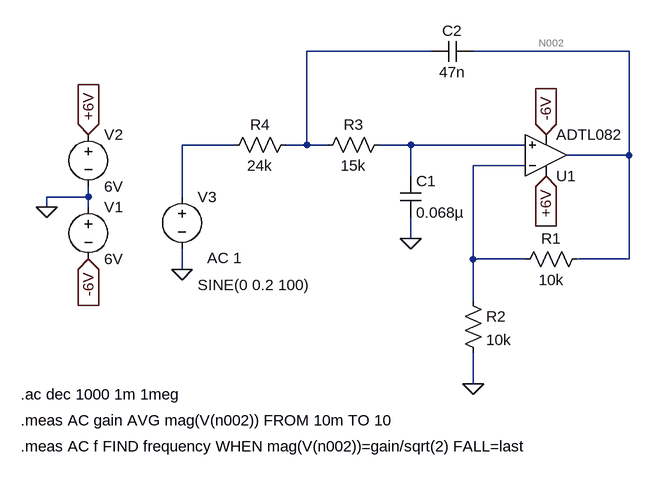
[diagram p0: schematic 150Hz_LPF_NI.asc]
150Hz_LPF_NI.asc, the LTspice schematic file:
Version 4
SHEET 1 880 680
WIRE 416 -64 224 -64
WIRE 720 -64 480 -64
WIRE 112 80 32 80
WIRE 224 80 224 -64
WIRE 224 80 192 80
WIRE 256 80 224 80
WIRE 384 80 336 80
WIRE 560 80 384 80
WIRE 720 96 720 -64
WIRE 720 96 624 96
WIRE 560 112 480 112
WIRE 384 128 384 80
WIRE -112 160 -112 144
WIRE -112 160 -176 160
WIRE 32 160 32 80
WIRE -176 176 -176 160
WIRE -112 176 -112 160
WIRE 384 224 384 192
WIRE 480 256 480 112
WIRE 560 256 480 256
WIRE 720 256 720 96
WIRE 720 256 640 256
WIRE 32 272 32 240
WIRE 480 320 480 256
WIRE 480 448 480 400
FLAG -176 176 0
FLAG -112 64 +6V
IOPIN -112 64 In
FLAG 592 128 +6V
IOPIN 592 128 In
FLAG -112 256 -6V
IOPIN -112 256 In
FLAG 592 64 -6V
IOPIN 592 64 In
FLAG 32 272 0
FLAG 480 448 0
FLAG 384 224 0
SYMBOL voltage -112 160 R0
WINDOW 123 0 0 Left 0
WINDOW 39 0 0 Left 0
SYMATTR InstName V1
SYMATTR Value 6V
SYMBOL voltage -112 48 R0
WINDOW 123 0 0 Left 0
WINDOW 39 0 0 Left 0
SYMATTR InstName V2
SYMATTR Value 6V
SYMBOL OpAmps\\ADTL082 592 160 M180
SYMATTR InstName U1
SYMBOL voltage 32 144 R0
WINDOW 3 24 152 Left 2
WINDOW 123 39 110 Left 2
WINDOW 39 0 0 Left 0
SYMATTR Value SINE(0 0.2 100)
SYMATTR Value2 AC 1
SYMATTR InstName V3
SYMBOL res 656 240 R90
WINDOW 0 0 56 VBottom 2
WINDOW 3 32 56 VTop 2
SYMATTR InstName R1
SYMATTR Value 10k
SYMBOL res 464 304 R0
SYMATTR InstName R2
SYMATTR Value 10k
SYMBOL cap 368 128 R0
SYMATTR InstName C1
SYMATTR Value 0.068µ
SYMBOL res 352 64 R90
WINDOW 0 0 56 VBottom 2
WINDOW 3 32 56 VTop 2
SYMATTR InstName R3
SYMATTR Value 15k
SYMBOL res 208 64 R90
WINDOW 0 0 56 VBottom 2
WINDOW 3 32 56 VTop 2
SYMATTR InstName R4
SYMATTR Value 24k
SYMBOL cap 480 -80 R90
WINDOW 0 0 32 VBottom 2
WINDOW 3 32 32 VTop 2
SYMATTR InstName C2
SYMATTR Value 47n
TEXT -216 464 Left 2 !.ac dec 1000 1m 1meg
TEXT -216 504 Left 2 !.meas AC gain AVG mag(V(n002)) FROM 10m TO 10
TEXT -216 544 Left 2 !.meas AC f FIND frequency WHEN mag(V(n002))=gain/sqrt(2) FALL=last

The netlist it stands for:
* 150Hz_LPF_NI.asc
V1 0 -6V 6V
V2 +6V 0 6V
XU1 N004 N005 +6V -6V N002 ADTL082  ; pins In+ In- V+ V- OUT
V3 N003 0 SINE(0 0.2 100) AC 1
R1 N002 N005 10k
R2 N005 0 10k
C1 N004 0 0.068µ
R3 N004 N001 15k
R4 N001 N003 24k
C2 N002 N001 47n
.ac dec 1000 1m 1meg
.meas AC gain AVG mag(V(n002)) FROM 10m TO 10
.meas AC f FIND frequency WHEN mag(V(n002))=gain/sqrt(2) FALL=last
.lib ADI.lib
.backanno
.end